# Altium schematic sheet Supplies.SchDoc
size A4
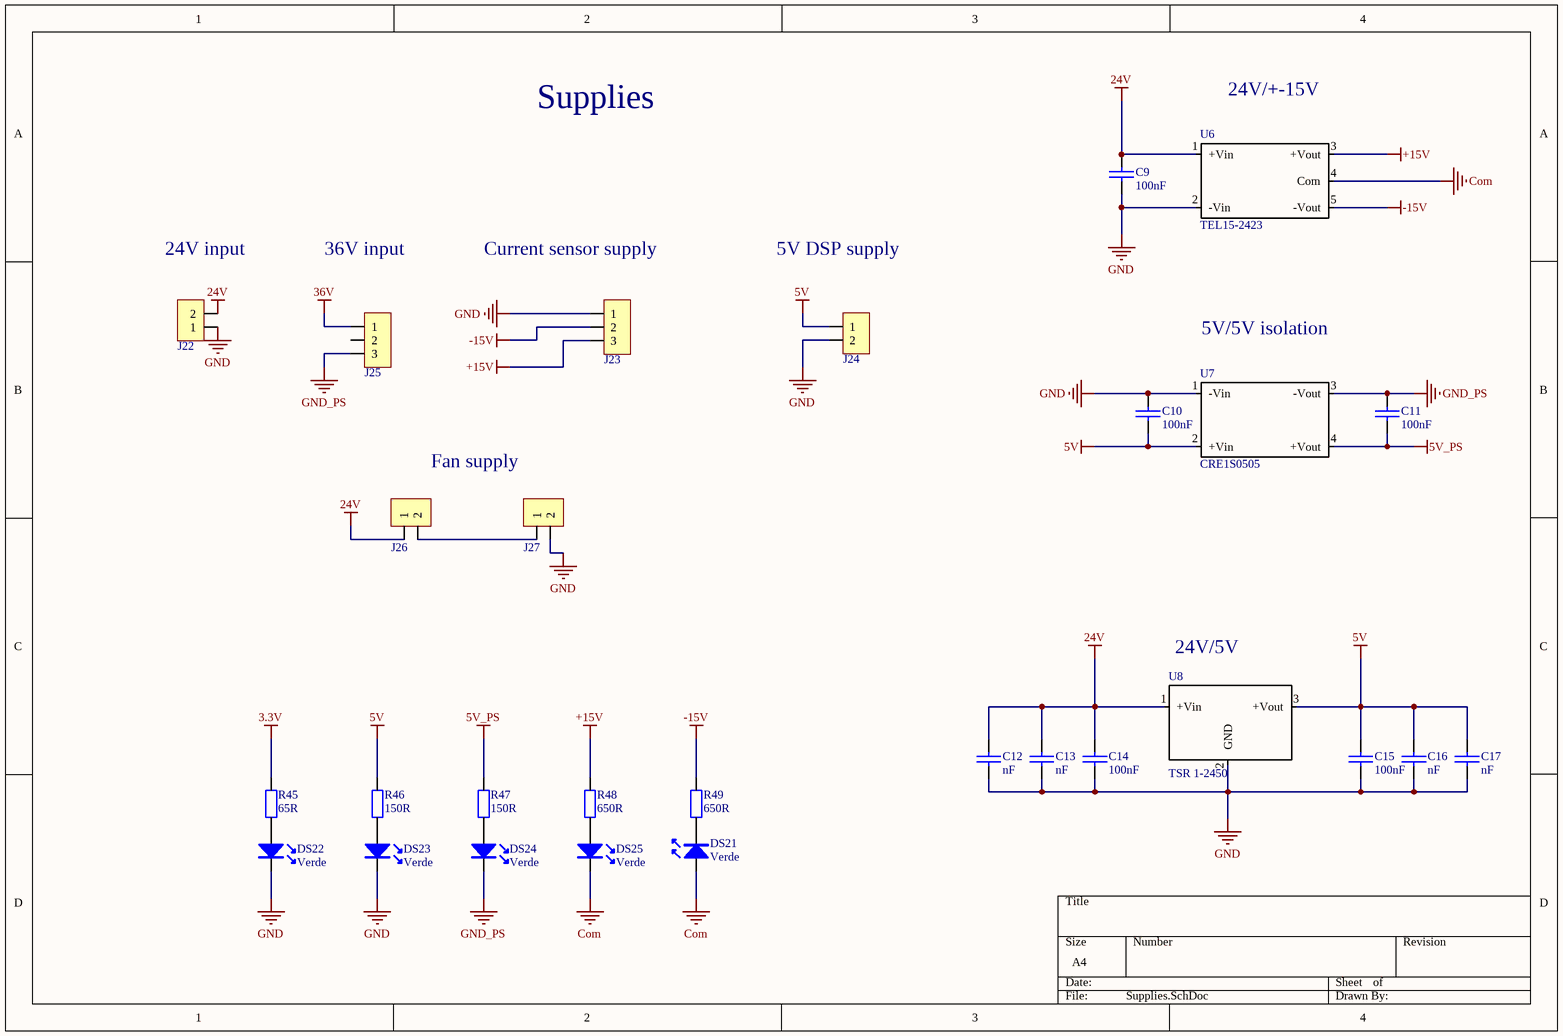
[diagram p0: Supplies.SchDoc]

## Parts
C9  100nF  [1206]
C10  100nF  [1206]
C11  100nF  [1206]
C12  nF  [1206]
C13  nF  [1206]
C14  100nF  [1206]
C15  100nF  [1206]
C16  nF  [1206]
C17  nF  [1206]
DS21  Verde  [LED_100mil]
DS22  Verde  [LED_100mil]
DS23  Verde  [LED_100mil]
DS24  Verde  [LED_100mil]
DS25  Verde  [LED_100mil]
J22  Cleva 2 vias  [Con2_ExtronSide_3.5mmPitch]  (value not drawn)
J23  Cur_meas_con  [Con3_KK_256]  (value not drawn)
J24  Cleva 2 vias  [Clema_2_vias]  (value not drawn)
J25  Cleva 2 vias  [Con3_150milPitch]  (value not drawn)
J26  Cleva 2 vias  [Con2_KK_256]  (value not drawn)
J27  Cleva 2 vias  [Con2_KK_256]  (value not drawn)
R45  65R  [1206]
R46  150R  [1206]
R47  150R  [1206]
R48  650R  [1206]
R49  650R  [1206]
U6  TEL15-2423  [TEL15-2423]
U7  CRE1S0505  [CRE1S0505SC]
U8  TSR 1-2450  [TSR 1-2450]

## Nets
3.3V: R45.1
5V: C10.2 C15.1 C16.1 C17.1 J24.1 R46.1 U7.2(+Vin) U8.3(+Vout)
5V_PS: C11.2 R47.1 U7.4(+Vout)
24V: C9.1 C12.1 C13.1 C14.1 J22.2 J26.1 U6.1(+Vin) U8.1(+Vin)
36V: J25.1
+15V: J23.3 R48.1 U6.3(+Vout)
-15V: J23.2 R49.1 U6.5(-Vout)
Com: DS21.A DS25.K U6.4(Com)
GND: C9.2 C10.1 C12.2 C13.2 C14.2 C15.2 C16.2 C17.2 DS22.K DS23.K J22.1 J23.1 J24.2 J27.2 U6.2(-Vin) U7.1(-Vin) U8.2(GND)
GND_PS: C11.1 DS24.K J25.3 U7.3(-Vout)
NetDS21_K: DS21.K R49.2
NetDS22_A: DS22.A R45.2
NetDS23_A: DS23.A R46.2
NetDS24_A: DS24.A R47.2
NetDS25_A: DS25.A R48.2
NetJ26_2: J26.2 J27.1

Not connected (* = marked no-connect by the designer): J25 2

## Notes on the sheet
- Supplies
- (near U6) 24V/+-15V
- (near J22) 24V input
- 36V input
- (near J23) Current sensor supply
- 5V DSP supply
- 5V/5V isolation
- Fan supply
- (near U8) 24V/5V

## Library data of the parts
C9-C17 = Condensador
DS21-DS25 = Led
J22 J24 J26 J27 = Con_2
J23 J25 = Con_3
R45-R49 = Resistencia: Potencia: 1/4W